# EAGLE design untitled (EAGLE 6.1)
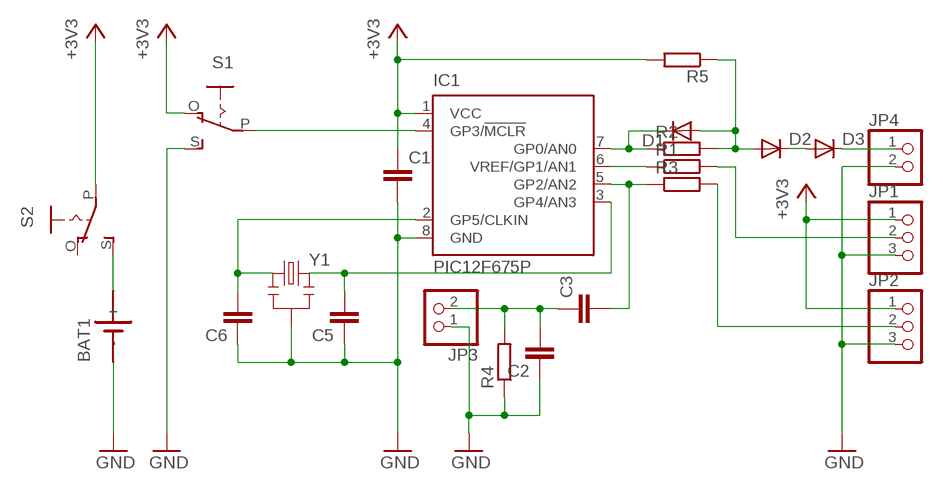
[diagram p0: schematic, sheet 1]

## Parts
BAT1  SN2032  [SN2032]
C1  C-EU025-025X050  [C025-025X050]
C2  C-EU025-025X050  [C025-025X050]
C3  C-EU025-025X050  [C025-025X050]
C5  C-EU025-025X050  [C025-025X050]
C6  C-EU025-025X050  [C025-025X050]
D1  DIODE-D-2.5  [D-2.5]
D2  DIODE-D-2.5  [D-2.5]
D3  DIODE-D-2.5  [D-2.5]
IC1  PIC12F675P  [DIL8]
JP1  PINHD-1X3  [1X03]
JP2  PINHD-1X3  [1X03]
JP3  PINHD-1X2  [1X02]
JP4  PINHD-1X2  [1X02]
R1  R-EU_0204/2V  [0204V]
R2  R-EU_0204/2V  [0204V]
R3  R-EU_0204/2V  [0204V]
R4  R-EU_0204/2V  [0204V]
R5  R-EU_0204/2V  [0204V]
S1  EG1218S  [EG1218]
S2  EG1218S  [EG1218]
Y1  RESONATORPTH  [RESONATOR-PTH]

## Nets
+3V3: C1.1 IC1.1(VCC) JP1.1 JP2.1 R5.2 S1.O S2.P
GND: BAT1.- C1.2 C2.1 C5.1 C6.1 IC1.8(GND) JP1.3 JP2.3 JP3.1 JP4.2 R4.1 S1.S Y1.2
N$1: C3.2 IC1.5(GP2/AN2) R3.1
N$2: IC1.6(VREF/GP1/AN1) R1.1
N$3: D1.C IC1.7(GP0/AN0) R2.1
N$4: C2.2 C3.1 JP3.2 R4.2
N$5: D3.C JP4.1
N$6: D2.C D3.A
N$7: D1.A D2.A R2.2 R5.1
N$8: C6.2 IC1.2(GP5/CLKIN) Y1.1
N$9: JP2.2 R3.2
N$10: IC1.4(GP3/!MCLR) S1.P
N$11: C5.2 IC1.3(GP4/AN3) Y1.3
N$12: JP1.2 R1.2
N$14: BAT1.+ S2.S
Unconnected: S2.O

## Library data of the parts
BAT1 = sn2032:SN2032: LI BATTERY
C1-C3 C5 C6 = rcl:C-EU: CAPACITOR, European symbol
D1-D3 = diode:DIODE-: DIODE
IC1 = microchip:PIC12F675: 8-Pin FLASH-Based 8-Bit CMOS Microcontroller Precision Internal 4 MHz oscillator factory calibrated to ±1% Low Power Features: Standby Current: - 1 nA @ 2.0V, typical Operating Current: - 8.5µA @ 32 kHz, 2.0V, typical - 100µA @ 1 MHz, 2.0V, typical Watchdog Timer Current: - 300 nA @ 2.0V, typical Timer1 oscillator current: - 4µA @ 32 kHz, 2.0V, typical Analog-to-Digital Converter module: - 10-bit resolution - Programmable 4-channel input - Voltage reference input Source: http://www.microchip.com .. 41190E.pdf; MF: MICROCHIP; MPN: PIC12F675-E/P; OC_FARNELL: 9759018; OC_NEWARK: 92C4340
JP1 JP2 = pinhead:PINHD-1X3: PIN HEADER
JP3 JP4 = pinhead:PINHD-1X2: PIN HEADER
R1-R5 = rcl:R-EU_: RESISTOR, European symbol
S1 S2 = _MY_OWN_LIB:EG1218: SLIDING SWITCH 0.1" spacing through hole, vertical SPDT slide switch http://www.ladyada.net/library/pcb/eaglelibrary.html
Y1 = SparkFun-FreqCtrl:RESONATOR: Resonator Small SMD resonator. Used, eg, on the Arduino Pro/ Pro Mini boards. 8MHz- XTAL-08895 16MHz- XTAL-08900

## Board
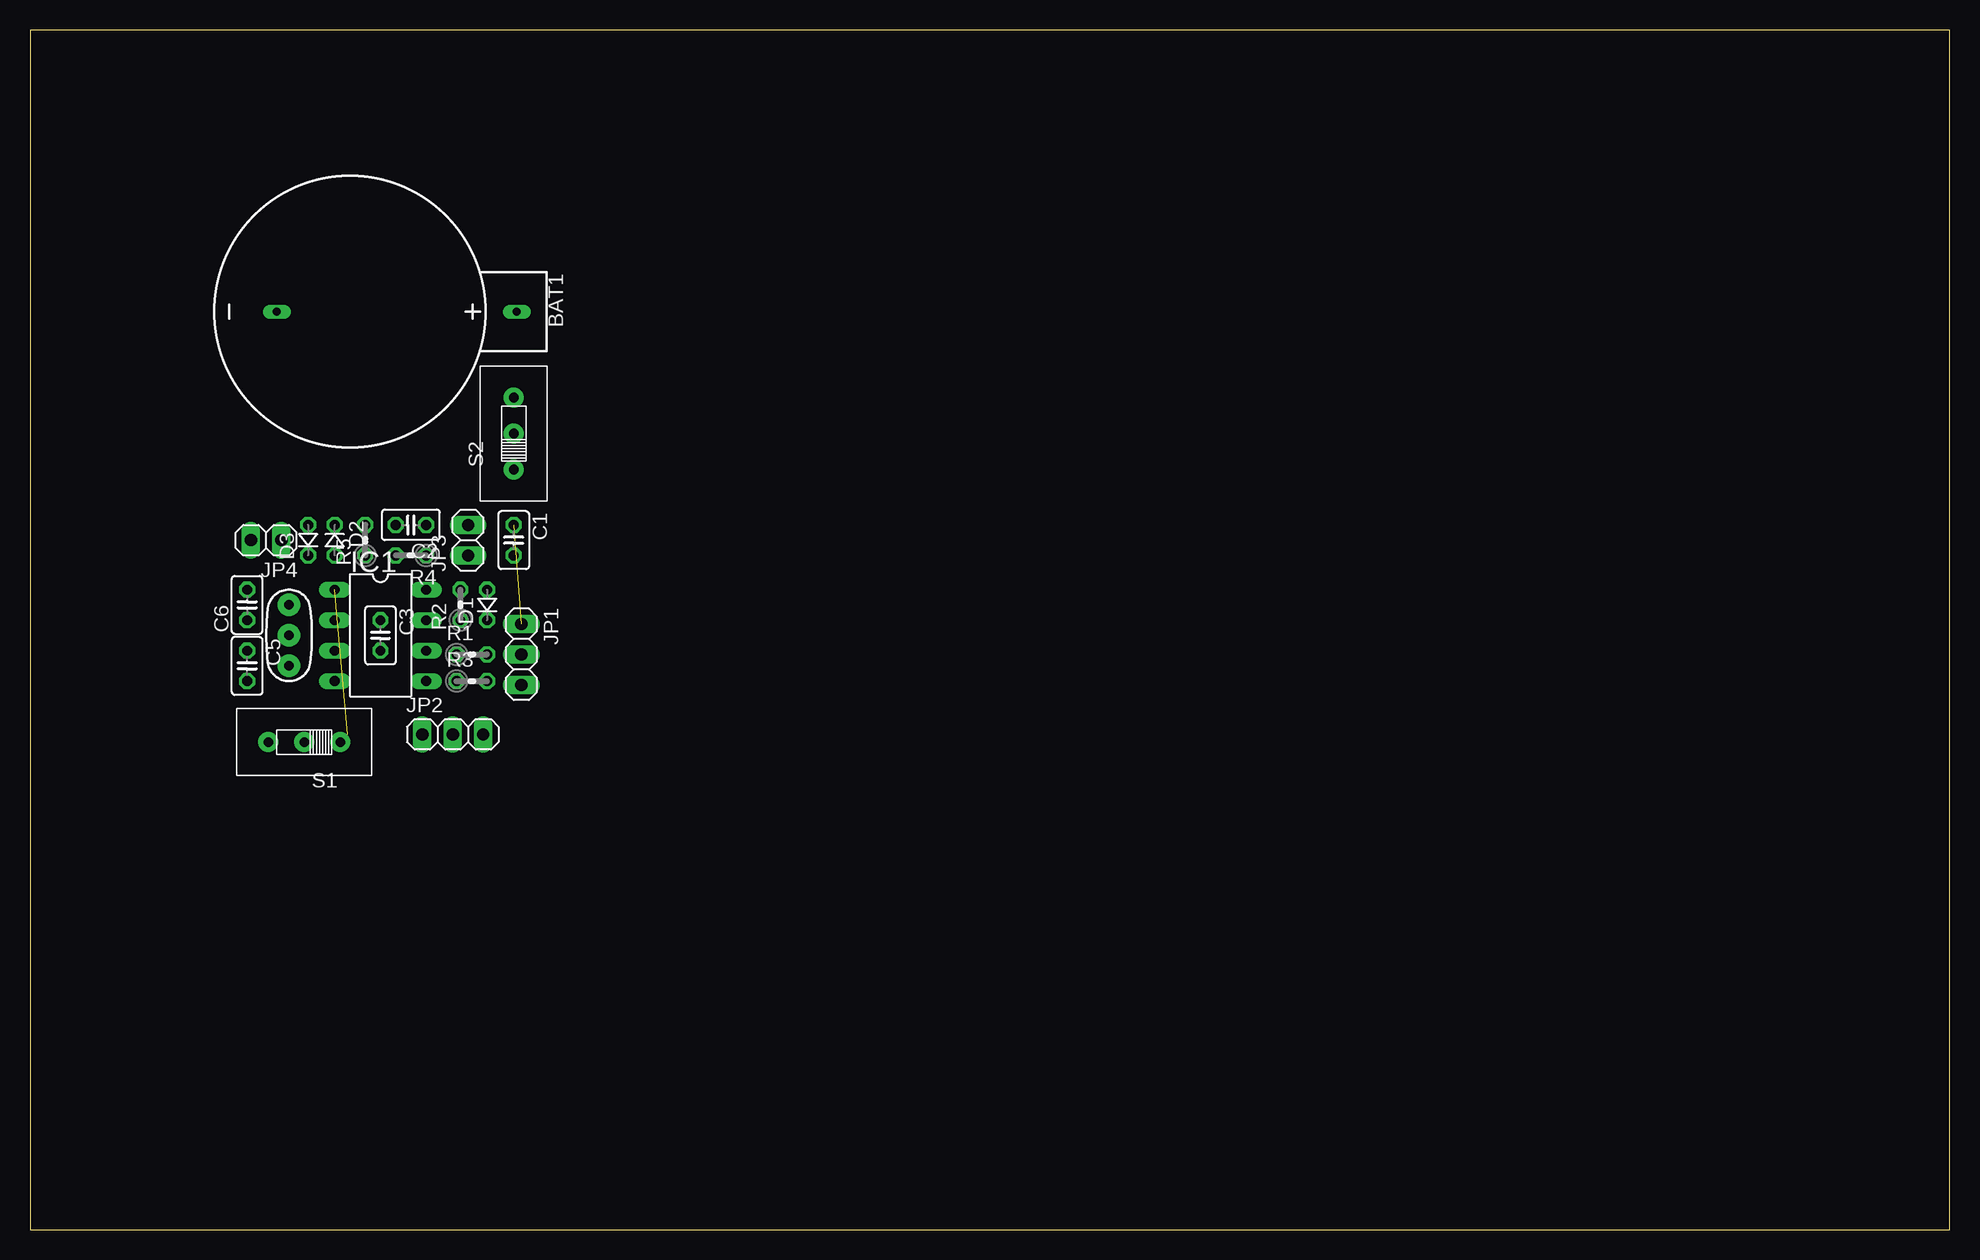
[diagram p1: board, top side]
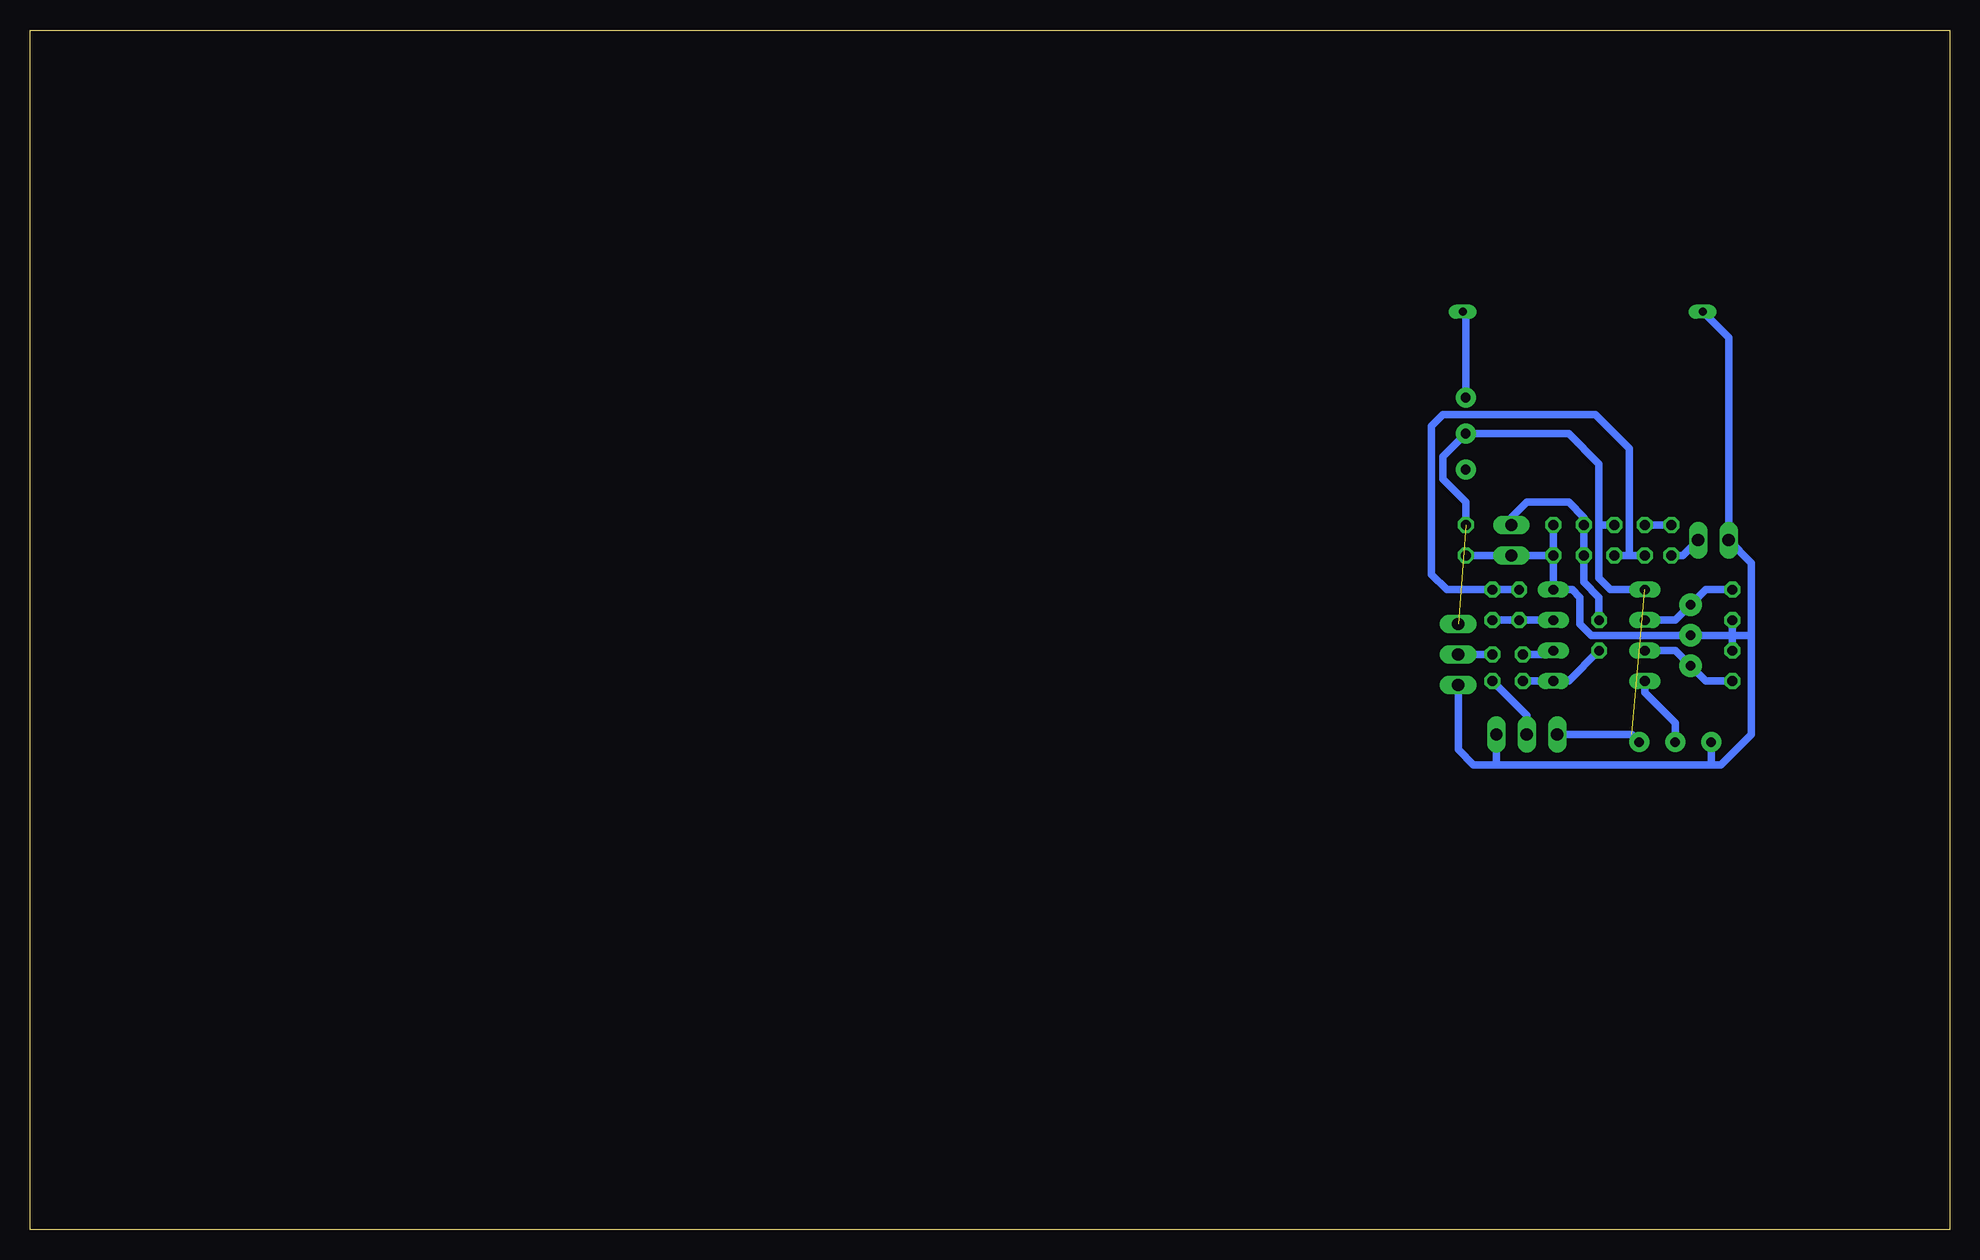
[diagram p2: board, bottom side, seen from below]

Size 160 x 100 mm. Coordinates in mm from the lower left corner, seen from the top.
Outline: 0,0 160,0 160,100 0,100 0,0
Copper layers (1*16): Top 0.035mm / dielectric 1.5mm / Bottom 0.035mm
Design rules: minimum track width 10mil, minimum drill 24mil, track to track 12mil, track to pad 12mil, pad to pad 12mil, via to via 12mil, smd to smd 10mil, copper to edge 12mil, drill to drill 12mil, minimum pad ring 10mil, minimum via ring 10mil, stop-mask expansion 4mil, vias tented up to drill 0mil, thermal gap 12mil

### Footprints (pad centres in the part's own frame; a part is rotated, then mirrored left to right if it is on the bottom)
SN2032 = drill 0.65 long: + 0,13.9; - 0,-6.1
C025-025X050 = drill 0.813 octagon: 1 -1.27,0; 2 1.27,0
D-2.5 = drill 0.813 octagon: A 1.27,0; C -1.27,0
DIL8 = drill 0.813 long: 1 -3.81,-3.81; 2 -1.27,-3.81; 3 1.27,-3.81; 4 3.81,-3.81; 5 3.81,3.81; 6 1.27,3.81; 7 -1.27,3.81; 8 -3.81,3.81
1X03 = drill 1.016 long: 1 -2.54,0; 2 0,0; 3 2.54,0
1X02 = drill 1.016 long: 1 -1.27,0; 2 1.27,0
0204V = drill 0.813 octagon: 1 -1.27,0; 2 1.27,0
EG1218 = drill 0.8 pad 1.676: O -3,0; P 0,0; S 3,0
RESONATOR-PTH = drill 0.8 pad 1.88: 1 -2.54,0; 2 0,0; 3 2.54,0

### Placement (x,y rotation side)
BAT1  26.67,76.52 270 top
C1  40.32,57.47 270 top
C2  31.75,58.74 180 top
C3  29.21,49.53 270 top
C5  18.1,46.99 270 top
C6  18.1,52.07 90 top
D1  38.1,52.07 90 top
D2  25.4,57.47 270 top
D3  23.18,57.47 90 top
IC1  29.21,49.53 270 top
JP1  40.96,47.94 270 top
JP2  35.24,41.27 0 top
JP3  36.51,57.47 90 top
JP4  19.68,57.47 180 top
R1  36.83,47.94 0 top
R2  35.88,52.07 90 top
R3  36.83,45.72 0 top
R4  31.75,56.2 180 top
R5  27.94,57.47 90 top
S1  22.86,40.64 180 top
S2  40.32,66.36 90 top
Y1  21.59,49.53 270 top

### Tracks (layer width: path | path; a pad name or v marks a point on that pad's centre or on a via)
+3V3  (2 unrouted)
  Bottom 0.61: 29.21,58.74 R5.2 | IC1.1 28.26,53.34 29.21,54.29 29.21,58.74 | 29.21,58.74 29.21,63.82 31.75,66.36 S2.P 42.23,64.45 42.23,62.55 40.32,60.64 C1.1 | JP2.1 26.5,41.27 S1.O
GND
  Bottom 0.61: 20,38.73 37.78,38.73 | 37.78,38.73 39.69,38.73 40.96,40.01 JP1.3 | 18.1,49.53 Y1.2 29.84,49.53 30.8,50.48 30.8,52.7 31.43,53.34 IC1.8 R4.1 | C5.1 18.1,49.53 | BAT1.- 18.41,74.36 JP4.2 16.51,55.56 16.51,49.53 | C2.1 R4.1 | R4.1 JP3.1 C1.2 | 16.51,49.53 16.51,41.27 19.05,38.73 20,38.73 | S1.S 19.86,38.88 20,38.73 | C6.1 18.1,49.53 | 18.1,49.53 16.51,49.53 | JP2.3 37.78,38.73
N$1
  Bottom 0.61: R3.1 IC1.5 31.75,45.72 C3.2
N$2
  Bottom 0.61: R1.1 33.34,47.94 IC1.6
N$3
  Bottom 0.61: IC1.7 R2.1 D1.C
N$4
  Bottom 0.61: C3.1 29.21,52.7 30.48,53.98 R4.2 C2.2 30.48,59.37 31.75,60.64 35.24,60.64 36.51,59.37 JP3.2
N$5
  Bottom 0.61: D3.C 22.23,56.2 JP4.1
N$6
  Bottom 0.61: D3.A D2.C
N$7
  Bottom 0.61: D1.A R2.2 41.91,53.34 43.18,54.61 43.18,66.99 42.23,67.94 29.53,67.94 26.67,65.09 26.67,56.2 | R5.1 26.67,56.2 | 26.67,56.2 D2.A
N$8
  Bottom 0.61: IC1.2 22.86,50.8 Y1.1 20.32,53.34 C6.2
N$9
  Bottom 0.61: JP2.2 35.24,42.86 R3.2
N$10
  Bottom 0.61: IC1.4 25.4,44.77 22.86,42.23 S1.P
N$11
  Bottom 0.61: C5.2 20.32,45.72 Y1.3 22.86,48.26 IC1.3
N$12
  Bottom 0.61: R1.2 JP1.2
N$14
  Bottom 0.61: 40.32,76.52 BAT1.+ 40.32,76.27 S2.S